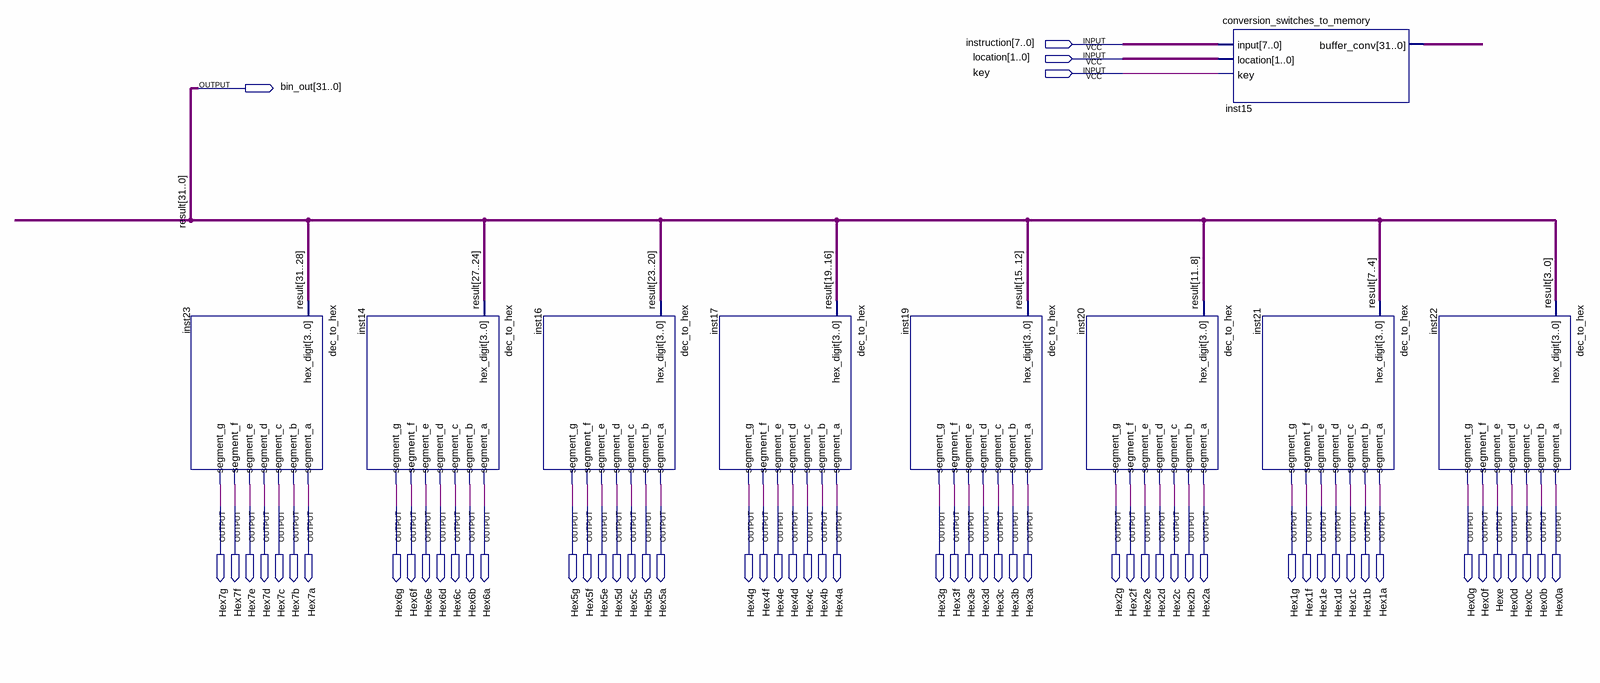
[diagram p0: schematic sheet]
// Quartus schematic de2componenets.bdf as structural Verilog: 9 symbols, 60 pins
module de2componenets (
  input  [7:0] instruction,
  input  [1:0] location,
  input  key,
  output [31:0] bin_out,
  output Hex7g,
  output Hex7f,
  output Hex7e,
  output Hex7d,
  output Hex7c,
  output Hex7b,
  output Hex7a,
  output Hex6g,
  output Hex6f,
  output Hex6e,
  output Hex6d,
  output Hex6c,
  output Hex6b,
  output Hex6a,
  output Hex5g,
  output Hex5f,
  output Hex5e,
  output Hex5d,
  output Hex5c,
  output Hex5b,
  output Hex5a,
  output Hex4g,
  output Hex4f,
  output Hex4e,
  output Hex4d,
  output Hex4c,
  output Hex4b,
  output Hex4a,
  output Hex3g,
  output Hex3f,
  output Hex3e,
  output Hex3d,
  output Hex3c,
  output Hex3b,
  output Hex3a,
  output Hex2g,
  output Hex2f,
  output Hex2e,
  output Hex2d,
  output Hex2c,
  output Hex2b,
  output Hex2a,
  output Hex1g,
  output Hex1f,
  output Hex1e,
  output Hex1d,
  output Hex1c,
  output Hex1b,
  output Hex1a,
  output Hex0g,
  output Hex0f,
  output Hexe,
  output Hex0d,
  output Hex0c,
  output Hex0b,
  output Hex0a
);

  wire [31:0] inst15_buffer_conv;

  dec_to_hex inst23 (
    .hex_digit(bin_out[31:28]), .segment_a(Hex7a), .segment_b(Hex7b), .segment_c(Hex7c), .segment_d(Hex7d),
    .segment_e(Hex7e), .segment_f(Hex7f), .segment_g(Hex7g));
  dec_to_hex inst14 (
    .hex_digit(bin_out[27:24]), .segment_a(Hex6a), .segment_b(Hex6b), .segment_c(Hex6c), .segment_d(Hex6d),
    .segment_e(Hex6e), .segment_f(Hex6f), .segment_g(Hex6g));
  dec_to_hex inst16 (
    .hex_digit(bin_out[23:20]), .segment_a(Hex5a), .segment_b(Hex5b), .segment_c(Hex5c), .segment_d(Hex5d),
    .segment_e(Hex5e), .segment_f(Hex5f), .segment_g(Hex5g));
  dec_to_hex inst17 (
    .hex_digit(bin_out[19:16]), .segment_a(Hex4a), .segment_b(Hex4b), .segment_c(Hex4c), .segment_d(Hex4d),
    .segment_e(Hex4e), .segment_f(Hex4f), .segment_g(Hex4g));
  dec_to_hex inst19 (
    .hex_digit(bin_out[15:12]), .segment_a(Hex3a), .segment_b(Hex3b), .segment_c(Hex3c), .segment_d(Hex3d),
    .segment_e(Hex3e), .segment_f(Hex3f), .segment_g(Hex3g));
  dec_to_hex inst20 (
    .hex_digit(bin_out[11:8]), .segment_a(Hex2a), .segment_b(Hex2b), .segment_c(Hex2c), .segment_d(Hex2d),
    .segment_e(Hex2e), .segment_f(Hex2f), .segment_g(Hex2g));
  conversion_switches_to_memory inst15 (
    .\input (instruction), .location(location), .key(key), .buffer_conv(inst15_buffer_conv));
  dec_to_hex inst21 (
    .hex_digit(bin_out[7:4]), .segment_a(Hex1a), .segment_b(Hex1b), .segment_c(Hex1c), .segment_d(Hex1d),
    .segment_e(Hex1e), .segment_f(Hex1f), .segment_g(Hex1g));
  dec_to_hex inst22 (
    .hex_digit(bin_out[3:0]), .segment_a(Hex0a), .segment_b(Hex0b), .segment_c(Hex0c), .segment_d(Hex0d),
    .segment_e(Hexe), .segment_f(Hex0f), .segment_g(Hex0g));

  // Other names for the same wires on the sheet: result[31:0] = bin_out
endmodule
